# EAGLE schematic Ikea DUKTIG plates (EAGLE 7.0.0)
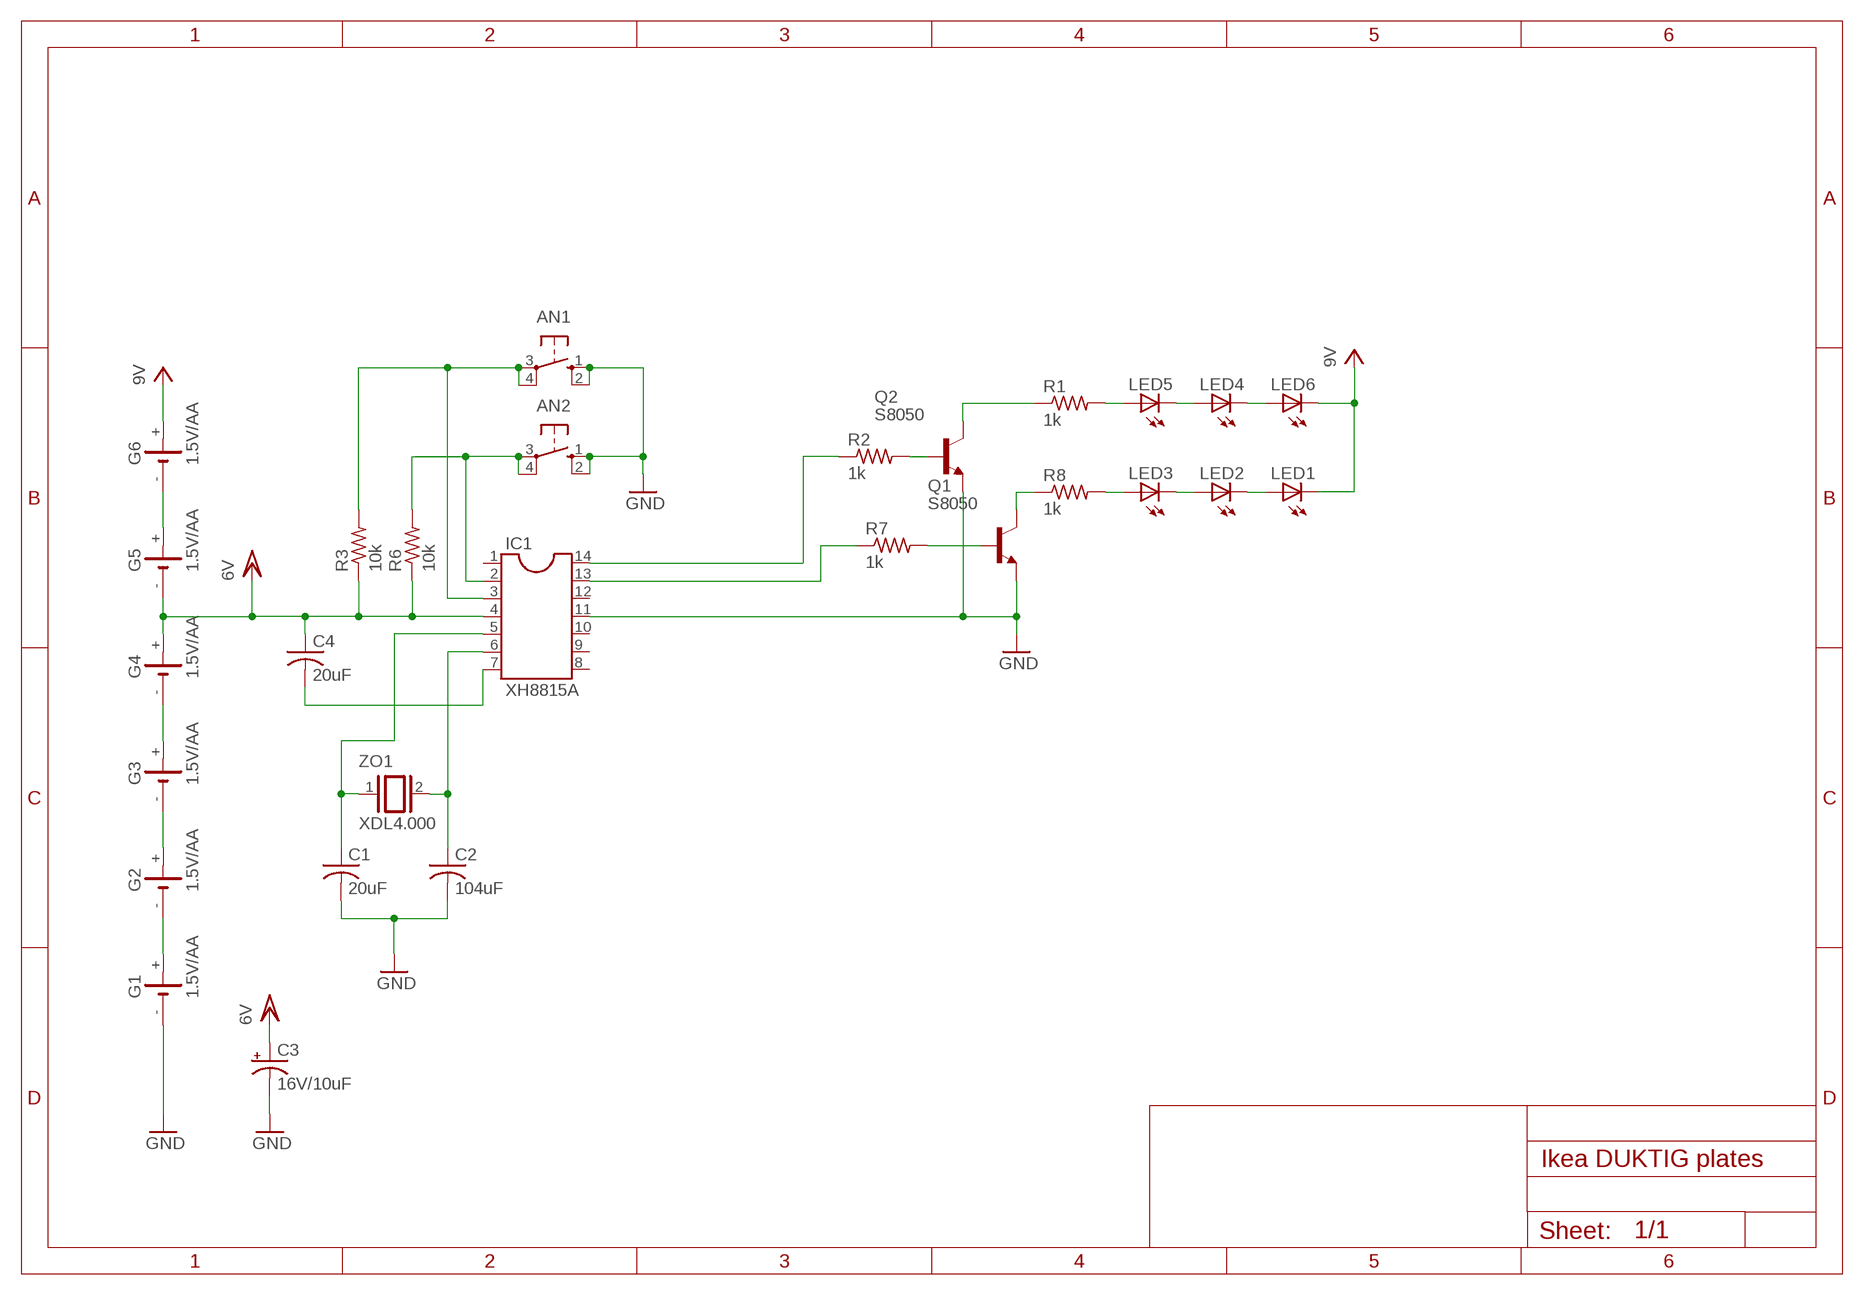
[diagram p0: schematic, sheet 1]

## Parts
AN1  40-XX  [B3F-40XX]
AN2  40-XX  [B3F-40XX]
C1  20uF  C-US025-024X044  [C025-024X044]
C2  104uF  C-US025-024X044  [C025-024X044]
C3  16V/10uF  CPOL-USE2-4  [E2-4]
C4  20uF  C-US025-024X044  [C025-024X044]
G1  1.5V/AA  SL-150-1/2AA/PR  [SL-150-1/2AA/PR]
G2  1.5V/AA  SL-150-1/2AA/PR  [SL-150-1/2AA/PR]
G3  1.5V/AA  SL-150-1/2AA/PR  [SL-150-1/2AA/PR]
G4  1.5V/AA  SL-150-1/2AA/PR  [SL-150-1/2AA/PR]
G5  1.5V/AA  SL-150-1/2AA/PR  [SL-150-1/2AA/PR]
G6  1.5V/AA  SL-150-1/2AA/PR  [SL-150-1/2AA/PR]
IC1  XH8815A  DIL14  [DIL14]
LED1  LED5MM  [LED5MM]
LED2  LED5MM  [LED5MM]
LED3  LED5MM  [LED5MM]
LED4  LED5MM  [LED5MM]
LED5  LED5MM  [LED5MM]
LED6  LED5MM  [LED5MM]
Q1  S8050  -NPN-TO92-CBE  [TO92-CBE]
Q2  S8050  -NPN-TO92-CBE  [TO92-CBE]
R1  1k  R-US_0204/5  [0204/5]
R2  1k  R-US_0204/5  [0204/5]
R3  10k  R-US_0204/5  [0204/5]
R6  10k  R-US_0204/5  [0204/5]
R7  1k  R-US_0204/5  [0204/5]
R8  1k  R-US_0204/5  [0204/5]
ZO1  XDL4.000  XTAL/S  [QS]

## Nets
GND: AN1.1(S) AN1.2(S1) AN2.1(S) AN2.2(S1) C1.2 C2.2 C3.- G1.- IC1.11 Q1.E Q2.E
N$1: G1.+ G2.-
N$2: G2.+ G3.-
N$3: G3.+ G4.-
N$4: Q1.C R8.1
N$5: G5.+ G6.-
N$6: LED3.A R8.2
N$7: LED2.A LED3.K(C)
N$8: LED1.A LED2.K(C)
N$9: LED4.A LED5.K(C)
N$10: Q1.B R7.2
N$11: IC1.13 R7.1
N$12: IC1.14 R2.1
N$13: Q2.B R2.2
N$14: LED4.K(C) LED6.A
N$15: Q2.C R1.1
N$16: LED5.A R1.2
N$17: AN2.3(P) AN2.4(P1) IC1.2 R6.2
N$18: AN1.3(P) AN1.4(P1) IC1.3 R3.2
N$19: C2.1 IC1.6 ZO1.2
N$20: C1.1 IC1.5 ZO1.1
N$22: C4.2 IC1.7
VCC: G6.+ LED1.K(C) LED6.K(C) ; supply symbol labelled 9V
VCC/2: C3.+ C4.1 G4.+ G5.- IC1.4 R3.1 R6.1 ; supply symbol labelled 6V
Unconnected: IC1.1 IC1.8 IC1.9 IC1.10 IC1.12

## Library data of the parts
AN1 AN2 = switch-omron:40-XX: OMRON SWITCH; MF: OMRON COMPONENTS USA; MPN: B3F-4000; OC_FARNELL: 176434; OC_NEWARK: 36K3105
C1 C2 C4 = rcl:C-US: CAPACITOR, American symbol
C3 = rcl:CPOL-US: POLARIZED CAPACITOR, American symbol
G1-G6 = battery:SL-150-1/2AA/PR: LI BATTERY Sonnenschein
IC1 = ic-package:DIL14: Dual In Line / Socket
LED1-LED6 = led:LED: LED OSRAM: - CHIPLED LG R971, LG N971, LY N971, LG Q971, LY Q971, LO R971, LY R971 LH N974, LH R974 LS Q976, LO Q976, LY Q976 LO Q996 - Hyper CHIPLED LW Q18S LB Q993, LB Q99A, LB R99A - SideLED LS A670, LO A670, LY A670, LG A670, LP A670 LB A673, LV A673, LT A673, LW A673 LH A674 LY A675 LS A676, LA A676, LO A676, LY A676, LW A676 LS A679, LY A679, LG A679 - Hyper Micro SIDELED® LS Y876, LA Y876, LO Y876, LY Y876 LT Y87S - SmartLED LW L88C, LW L88S LB L89C, LB L89S, LG L890 LS L89K, LO L89K, LY L89K LS L896, LA L896, LO L896, LY L896 - TOPLED LS T670, LO T670, LY T670, LG T670, LP T670 LSG T670, LSP T670, LSY T670, LOP T670, LYG T670 LG T671, LOG T671, LSG T671 LB T673, LV T673, LT T673, LW T673 LH T674 LS T676, LA T676, LO T676, LY T676, LB T676, LH T676, LSB T676, LW T676 LB T67C, LV T67C, LT T67C, LS T67K, LO T67K, LY T67K, LW E67C LS E67B, LA E67B, LO E67B, LY E67B, LB E67C, LV E67C, LT E67C LW T67C LS T679, LY T679, LG T679 LS T770, LO T770, LY T770, LG T770, LP T770 LB T773, LV T773, LT T773, LW T773 LH T774 LS E675, LA E675, LY E675, LS T675 LS T776, LA T776, LO T776, LY T776, LB T776 LHGB T686 LT T68C, LB T68C - Hyper Mini TOPLED® LB M676 - Mini TOPLED Santana® LG M470 LS M47K, LO M47K, LY M47K Source: http://www.osram.convergy.de LUXEON: - LUMILED® LXK2-PW12-R00, LXK2-PW12-S00, LXK2-PW14-U00, LXK2-PW14-V00 LXK2-PM12-R00, LXK2-PM12-S00, LXK2-PM14-U00 LXK2-PE12-Q00, LXK2-PE12-R00, LXK2-PE12-S00, LXK2-PE14-T00, LXK2-PE14-U00 LXK2-PB12-K00, LXK2-PB12-L00, LXK2-PB12-M00, LXK2-PB14-N00, LXK2-PB14-P00, LXK2-PB14-Q00 LXK2-PR12-L00, LXK2-PR12-M00, LXK2-PR14-Q00, LXK2-PR14-R00 LXK2-PD12-Q00, LXK2-PD12-R00, LXK2-PD12-S00 LXK2-PH12-R00, LXK2-PH12-S00 LXK2-PL12-P00, LXK2-PL12-Q00, LXK2-PL12-R00 Source: www.luxeon.com KINGBRIGHT: KA-3528ASYC Source: www.kingbright.com
Q1 Q2 = transistor-neu-to92:*-NPN-: NPN Transistror
R1-R3 R6-R8 = rcl:R-US_: RESISTOR, American symbol
ZO1 = special:XTAL/S: CRYSTAL